# Altium schematic sheet Shifts-DACs.SchDoc
size A2
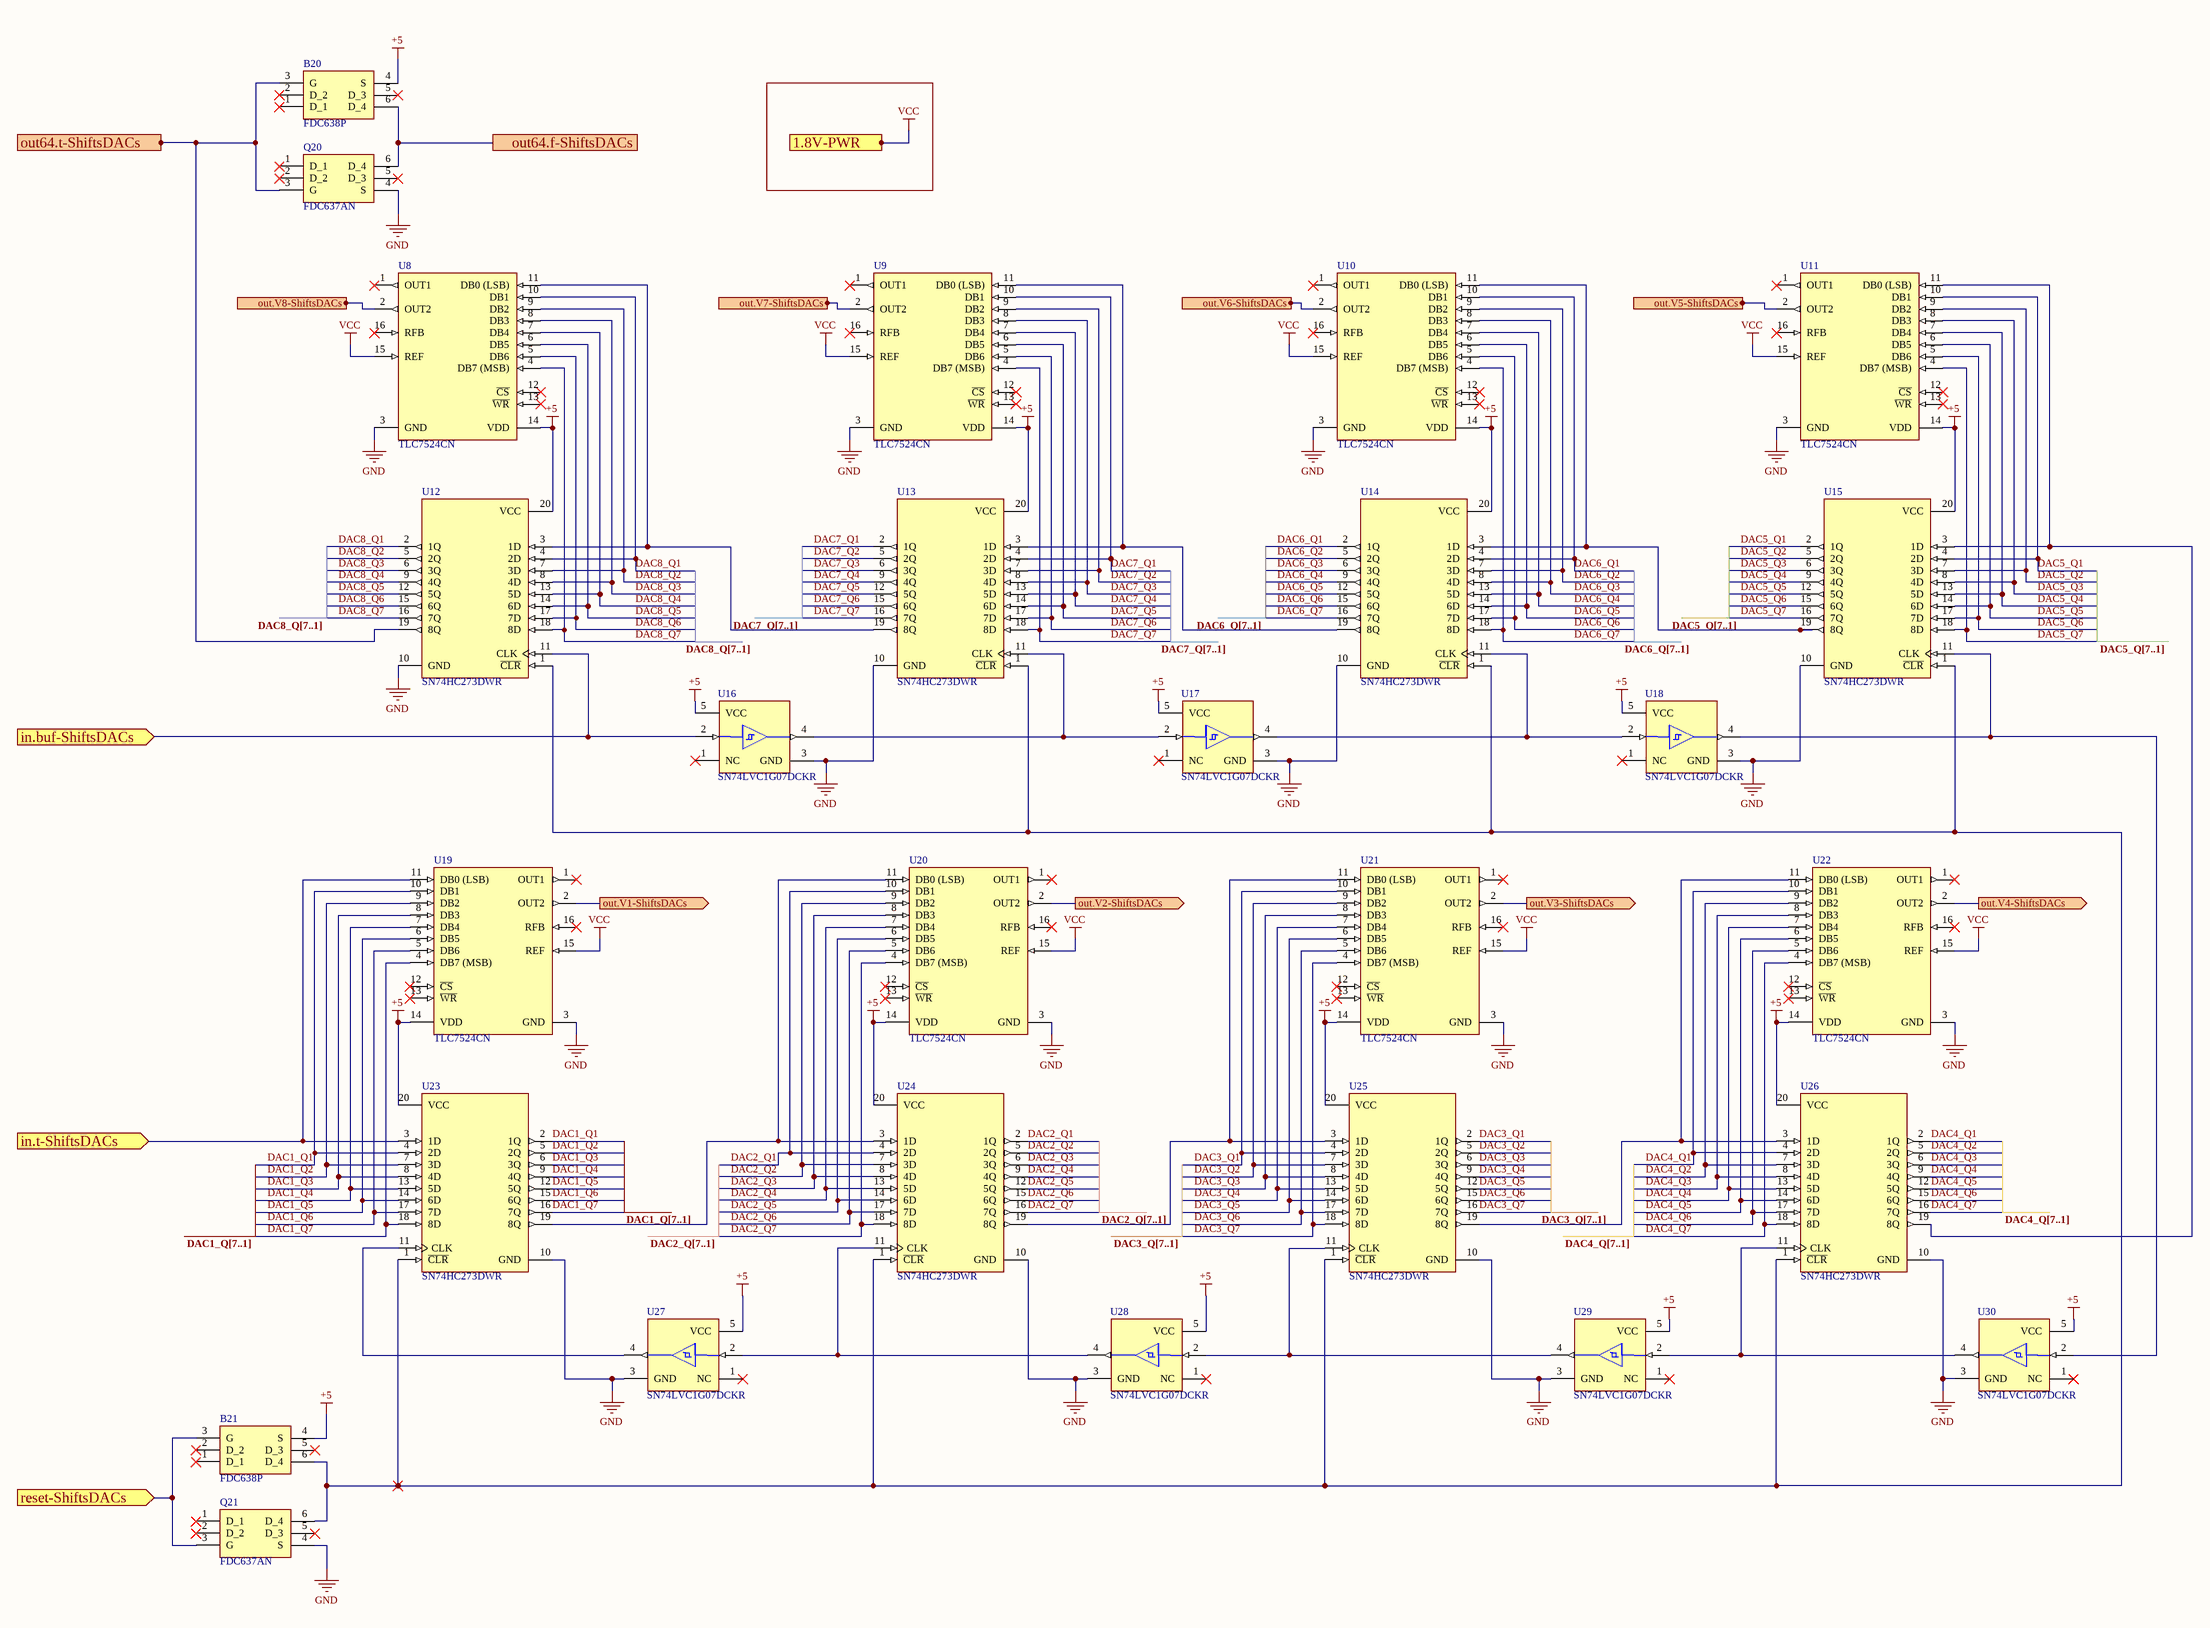
[diagram p0: Shifts-DACs.SchDoc]

## Parts
B20  FDC638P  [SOT95P275X110-6N]
B21  FDC638P  [SOT95P275X110-6N]
Q20  FDC637AN  [SOT95P275X110-6N]
Q21  FDC637AN  [SOT95P275X110-6N]
U8  TLC7524CN  [TI-N16]
U9  TLC7524CN  [TI-N16]
U10  TLC7524CN  [TI-N16]
U11  TLC7524CN  [TI-N16]
U12  SN74HC273DWR  [FP-DW0020A-IPC_A]
U13  SN74HC273DWR  [FP-DW0020A-IPC_A]
U14  SN74HC273DWR  [FP-DW0020A-IPC_A]
U15  SN74HC273DWR  [FP-DW0020A-IPC_A]
U16  SN74LVC1G07DCKR  [FP-DCK0005A-MFG]
U17  SN74LVC1G07DCKR  [FP-DCK0005A-MFG]
U18  SN74LVC1G07DCKR  [FP-DCK0005A-MFG]
U19  TLC7524CN  [TI-N16]
U20  TLC7524CN  [TI-N16]
U21  TLC7524CN  [TI-N16]
U22  TLC7524CN  [TI-N16]
U23  SN74HC273DWR  [FP-DW0020A-IPC_A]
U24  SN74HC273DWR  [FP-DW0020A-IPC_A]
U25  SN74HC273DWR  [FP-DW0020A-IPC_A]
U26  SN74HC273DWR  [FP-DW0020A-IPC_A]
U27  SN74LVC1G07DCKR  [FP-DCK0005A-MFG]
U28  SN74LVC1G07DCKR  [FP-DCK0005A-MFG]
U29  SN74LVC1G07DCKR  [FP-DCK0005A-MFG]
U30  SN74LVC1G07DCKR  [FP-DCK0005A-MFG]

## Ports
1.8V-PWR (in), in.buf-ShiftsDACs (in), in.t-ShiftsDACs (in), out64.f-ShiftsDACs (out), out64.t-ShiftsDACs (out), out.V1-ShiftsDACs (out), out.V2-ShiftsDACs (out), out.V3-ShiftsDACs (out), out.V4-ShiftsDACs (out), out.V5-ShiftsDACs (out), out.V6-ShiftsDACs (out), out.V7-ShiftsDACs (out), out.V8-ShiftsDACs (out), reset-ShiftsDACs (in)

## Nets
+5: B20.4(S) B21.4(S) U8.14(VDD) U9.14(VDD) U10.14(VDD) U11.14(VDD) U12.20(VCC) U13.20(VCC) U14.20(VCC) U15.20(VCC) U16.5(VCC) U17.5(VCC) U18.5(VCC) U19.14(VDD) U20.14(VDD) U21.14(VDD) U22.14(VDD) U23.20(VCC) U24.20(VCC) U25.20(VCC) U26.20(VCC) U27.5(VCC) U28.5(VCC) U29.5(VCC) U30.5(VCC)
GND: Q20.4(S) Q21.4(S) U8.3(GND) U9.3(GND) U10.3(GND) U11.3(GND) U12.10(GND) U13.10(GND) U14.10(GND) U15.10(GND) U16.3(GND) U17.3(GND) U18.3(GND) U19.3(GND) U20.3(GND) U21.3(GND) U22.3(GND) U23.10(GND) U24.10(GND) U25.10(GND) U26.10(GND) U27.3(GND) U28.3(GND) U29.3(GND) U30.3(GND)
VCC: U8.15(REF) U9.15(REF) U10.15(REF) U11.15(REF) U19.15(REF) U20.15(REF) U21.15(REF) U22.15(REF) ; port 1.8V-PWR
DAC1_Q1: U19.10(DB1) U23.2(1Q) U23.4(2D)
DAC1_Q2: U19.9(DB2) U23.5(2Q) U23.7(3D)
DAC1_Q3: U19.8(DB3) U23.6(3Q) U23.8(4D)
DAC1_Q4: U19.7(DB4) U23.9(4Q) U23.13(5D)
DAC1_Q5: U19.6(DB5) U23.12(5Q) U23.14(6D)
DAC1_Q6: U19.5(DB6) U23.15(6Q) U23.17(7D)
DAC1_Q7: U19.4(DB7_(MSB)) U23.16(7Q) U23.18(8D)
DAC2_Q1: U20.10(DB1) U24.2(1Q) U24.4(2D)
DAC2_Q2: U20.9(DB2) U24.5(2Q) U24.7(3D)
DAC2_Q3: U20.8(DB3) U24.6(3Q) U24.8(4D)
DAC2_Q4: U20.7(DB4) U24.9(4Q) U24.13(5D)
DAC2_Q5: U20.6(DB5) U24.12(5Q) U24.14(6D)
DAC2_Q6: U20.5(DB6) U24.15(6Q) U24.17(7D)
DAC2_Q7: U20.4(DB7_(MSB)) U24.16(7Q) U24.18(8D)
DAC3_Q1: U21.10(DB1) U25.2(1Q) U25.4(2D)
DAC3_Q2: U21.9(DB2) U25.5(2Q) U25.7(3D)
DAC3_Q3: U21.8(DB3) U25.6(3Q) U25.8(4D)
DAC3_Q4: U21.7(DB4) U25.9(4Q) U25.13(5D)
DAC3_Q5: U21.6(DB5) U25.12(5Q) U25.14(6D)
DAC3_Q6: U21.5(DB6) U25.15(6Q) U25.17(7D)
DAC3_Q7: U21.4(DB7_(MSB)) U25.16(7Q) U25.18(8D)
DAC4_Q1: U22.10(DB1) U26.2(1Q) U26.4(2D)
DAC4_Q2: U22.9(DB2) U26.5(2Q) U26.7(3D)
DAC4_Q3: U22.8(DB3) U26.6(3Q) U26.8(4D)
DAC4_Q4: U22.7(DB4) U26.9(4Q) U26.13(5D)
DAC4_Q5: U22.6(DB5) U26.12(5Q) U26.14(6D)
DAC4_Q6: U22.5(DB6) U26.15(6Q) U26.17(7D)
DAC4_Q7: U22.4(DB7_(MSB)) U26.16(7Q) U26.18(8D)
DAC5_Q1: U11.10(DB1) U15.2(1Q) U15.4(2D)
DAC5_Q2: U11.9(DB2) U15.5(2Q) U15.7(3D)
DAC5_Q3: U11.8(DB3) U15.6(3Q) U15.8(4D)
DAC5_Q4: U11.7(DB4) U15.9(4Q) U15.13(5D)
DAC5_Q5: U11.6(DB5) U15.12(5Q) U15.14(6D)
DAC5_Q6: U11.5(DB6) U15.15(6Q) U15.17(7D)
DAC5_Q7: U11.4(DB7_(MSB)) U15.16(7Q) U15.18(8D)
DAC6_Q1: U10.10(DB1) U14.2(1Q) U14.4(2D)
DAC6_Q2: U10.9(DB2) U14.5(2Q) U14.7(3D)
DAC6_Q3: U10.8(DB3) U14.6(3Q) U14.8(4D)
DAC6_Q4: U10.7(DB4) U14.9(4Q) U14.13(5D)
DAC6_Q5: U10.6(DB5) U14.12(5Q) U14.14(6D)
DAC6_Q6: U10.5(DB6) U14.15(6Q) U14.17(7D)
DAC6_Q7: U10.4(DB7_(MSB)) U14.16(7Q) U14.18(8D)
DAC7_Q1: U9.10(DB1) U13.2(1Q) U13.4(2D)
DAC7_Q2: U9.9(DB2) U13.5(2Q) U13.7(3D)
DAC7_Q3: U9.8(DB3) U13.6(3Q) U13.8(4D)
DAC7_Q4: U9.7(DB4) U13.9(4Q) U13.13(5D)
DAC7_Q5: U9.6(DB5) U13.12(5Q) U13.14(6D)
DAC7_Q6: U9.5(DB6) U13.15(6Q) U13.17(7D)
DAC7_Q7: U9.4(DB7_(MSB)) U13.16(7Q) U13.18(8D)
DAC8_Q1: U8.10(DB1) U12.2(1Q) U12.4(2D)
DAC8_Q2: U8.9(DB2) U12.5(2Q) U12.7(3D)
DAC8_Q3: U8.8(DB3) U12.6(3Q) U12.8(4D)
DAC8_Q4: U8.7(DB4) U12.9(4Q) U12.13(5D)
DAC8_Q5: U8.6(DB5) U12.12(5Q) U12.14(6D)
DAC8_Q6: U8.5(DB6) U12.15(6Q) U12.17(7D)
DAC8_Q7: U8.4(DB7_(MSB)) U12.16(7Q) U12.18(8D)
in.buf-ShiftsDACs: U12.11(CLK) U16.2(A) ; port in.buf-ShiftsDACs
in.t-ShiftsDACs: U19.11(DB0_(LSB)) U23.3(1D) ; port in.t-ShiftsDACs
out64.t-ShiftsDACs: B20.3(G) Q20.3(G) U12.19(8Q) ; port out64.t-ShiftsDACs
out.V1-ShiftsDACs: U19.2(OUT2) ; port out.V1-ShiftsDACs
out.V2-ShiftsDACs: U20.2(OUT2) ; port out.V2-ShiftsDACs
out.V3-ShiftsDACs: U21.2(OUT2) ; port out.V3-ShiftsDACs
out.V4-ShiftsDACs: U22.2(OUT2) ; port out.V4-ShiftsDACs
out.V5-ShiftsDACs: U11.2(OUT2) ; port out.V5-ShiftsDACs
out.V6-ShiftsDACs: U10.2(OUT2) ; port out.V6-ShiftsDACs
out.V7-ShiftsDACs: U9.2(OUT2) ; port out.V7-ShiftsDACs
out.V8-ShiftsDACs: U8.2(OUT2) ; port out.V8-ShiftsDACs
reset-ShiftsDACs: B21.3(G) Q21.3(G) ; port reset-ShiftsDACs
NetB20_6: B20.6(D_4) Q20.6(D_4)
NetB21_6: B21.6(D_4) Q21.6(D_4) U12.1(~{CLR}) U13.1(~{CLR}) U14.1(~{CLR}) U15.1(~{CLR}) U23.1(~{CLR}) U24.1(~{CLR}) U25.1(~{CLR}) U26.1(~{CLR})
NetU8_11: U8.11(DB0_(LSB)) U12.3(1D) U13.19(8Q)
NetU9_11: U9.11(DB0_(LSB)) U13.3(1D) U14.19(8Q)
NetU10_11: U10.11(DB0_(LSB)) U14.3(1D) U15.19(8Q)
NetU11_11: U11.11(DB0_(LSB)) U15.3(1D) U26.19(8Q)
NetU13_11: U13.11(CLK) U16.4(Y) U17.2(A)
NetU14_11: U14.11(CLK) U17.4(Y) U18.2(A)
NetU15_11: U15.11(CLK) U18.4(Y) U30.2(A)
NetU20_11: U20.11(DB0_(LSB)) U23.19(8Q) U24.3(1D)
NetU21_11: U21.11(DB0_(LSB)) U24.19(8Q) U25.3(1D)
NetU22_11: U22.11(DB0_(LSB)) U25.19(8Q) U26.3(1D)
NetU23_11: U23.11(CLK) U27.4(Y)
NetU24_11: U24.11(CLK) U27.2(A) U28.4(Y)
NetU25_11: U25.11(CLK) U28.2(A) U29.4(Y)
NetU26_11: U26.11(CLK) U29.2(A) U30.4(Y)

Not connected (* = marked no-connect by the designer): B20 1(D_1)* 2(D_2)* 5(D_3)*; B21 1(D_1)* 2(D_2)* 5(D_3)*; Q20 1(D_1)* 2(D_2)* 5(D_3)*; Q21 1(D_1)* 2(D_2)* 5(D_3)*; U8 1(OUT1)* 12(~{CS})* 13(~{WR})* 16(RFB)*; U9 1(OUT1)* 12(~{CS})* 13(~{WR})* 16(RFB)*; U10 1(OUT1)* 12(~{CS})* 13(~{WR})* 16(RFB)*; U11 1(OUT1)* 12(~{CS})* 13(~{WR})* 16(RFB)*; U16 1(NC)*; U17 1(NC)*; U18 1(NC)*; U19 1(OUT1)* 12(~{CS})* 13(~{WR})* 16(RFB)*; U20 1(OUT1)* 12(~{CS})* 13(~{WR})* 16(RFB)*; U21 1(OUT1)* 12(~{CS})* 13(~{WR})* 16(RFB)*; U22 1(OUT1)* 12(~{CS})* 13(~{WR})* 16(RFB)*; U27 1(NC)*; U28 1(NC)*; U29 1(NC)*; U30 1(NC)*

## Buses and harness runs
bus DAC1_Q[7..1]
bus DAC2_Q[7..1]
bus DAC3_Q[7..1]
bus DAC4_Q[7..1]
bus DAC5_Q[7..1]
bus DAC6_Q[7..1]
bus DAC7_Q[7..1]
bus DAC8_Q[7..1]

## Library data of the parts
B20 B21 = CMP-007-000000-1: Low gate charge (10 nC typical); Manufacturer_Name: onsemi; Geometry.Height: 1.1mm; Datasheet Link: https://www.onsemi.com/pub/Collateral/FDC638P-D.PDF; Arrow Price/Stock: *; Design Item ID: FDC638P; Mouser Part Number: 512-FDC638P; Manufacturer_Part_Number: FDC638P; Mouser Price/Stock: https://www.mouser.co.uk/ProductDetail/onsemi-Fairchild/FDC638P?qs=FOlmdCx%252BAA16kOuf%252Brkheg%3D%3D; Source: FDC638P.SchLib; Arrow Part Number: *
Q20 Q21 = CMP-005-000000-4: Low gate charge (10.5nC typical).; Manufacturer_Name: onsemi; Geometry.Height: 1.1mm; Mouser Part Number: 512-FDC637AN; Source: FDC637AN.SchLib; Arrow Part Number: FDC637AN; Datasheet Link: https://www.onsemi.com/pub/Collateral/FDC637AN-D.PDF; Arrow Price/Stock: https://www.arrow.com/en/products/fdc637an/on-semiconductor?region=nac; Manufacturer_Part_Number: FDC637AN; Mouser Price/Stock: https://www.mouser.co.uk/ProductDetail/ON-Semiconductor-Fairchild/FDC637AN?qs=utFvTgNEmG6iAEUdTAueXw%3D%3D; Design Item ID: FDC637AN
U8-U11 U19-U22 = CMP-0004-00907-1: 8-Bit, 0.1 us MDAC, Parallel Input, Fast Control Signalling for DSP, Easy Micro Interface, 0 to 70 degC, 16-pin DIP (N16), Pb-Free (RoHS); Manufacturer: Texas Instruments; INL(Max)(+/-LSB): 0.5; Settling Time(us): 0.1; DAC Channels: 1; Resolution(Bits): 8; SubFamily: Precision DAC (=<10MSPS); ComponentLink2URL: http://www.ti.com/general/docs/lit/getliterature.tsp?genericPartNumber=TLC7524&fileType=pdf; ComponentLink2Description: Datasheet; ComponentLink3Description: Package Specification; PackageReference: N16; Code_JEDEC: MS-001; ComponentLink1Description: Manufacturer URL; DatasheetVersion: SLAS061D; PartNumber: TLC7524CN; Interface: Parallel; ComponentLink3URL: http://www.ti.com/litv/pdf/mpdi002c; Eco-Plan: Pb-Free (RoHS); Mounting Technology: Through Hole; PackageVersion: 4040049/E, 12/2002; DNL(Max)(+/-LSB): 0.5; ComponentLink1URL: http://www.ti.com/; PackageDescription: 16-Pin Plastic In-Line, Body 19.305 x 6.35 mm, Pitch 2.54 mm
U12-U15 U23-U26 = CMP-00023-00003-2: D Flip-Flop, HC/UH Series, 1-Func, Positive Edge Triggered, 8-Bit, True Output, CMOS, PDSO20; Pins: 20; Case/Package: SOP; RoHS Compliant: Yes; Min Operating Temperature: -40°C; Max Operating Temperature: 85°C
U16-U18 U27-U30 = CMP-00023-00004-1: Buffer, LVC/LCX/Z Series, 1-Func, 1-Input, CMOS, PDSO5; Min Operating Temperature: -40°C; Pins: 5; Case/Package: TSSOP; Max Operating Temperature: 125°C; RoHS Compliant: Yes